# EAGLE design SuperTester-v08 (EAGLE 6.5.0)
FIRST Robotics Team 997 SuperTester An all-in-one tester to combine a multiple number of electronic system testers into one unit.
DATABASE: ./BOM/SuperTester-PARTSDB.txt; REVISION: D
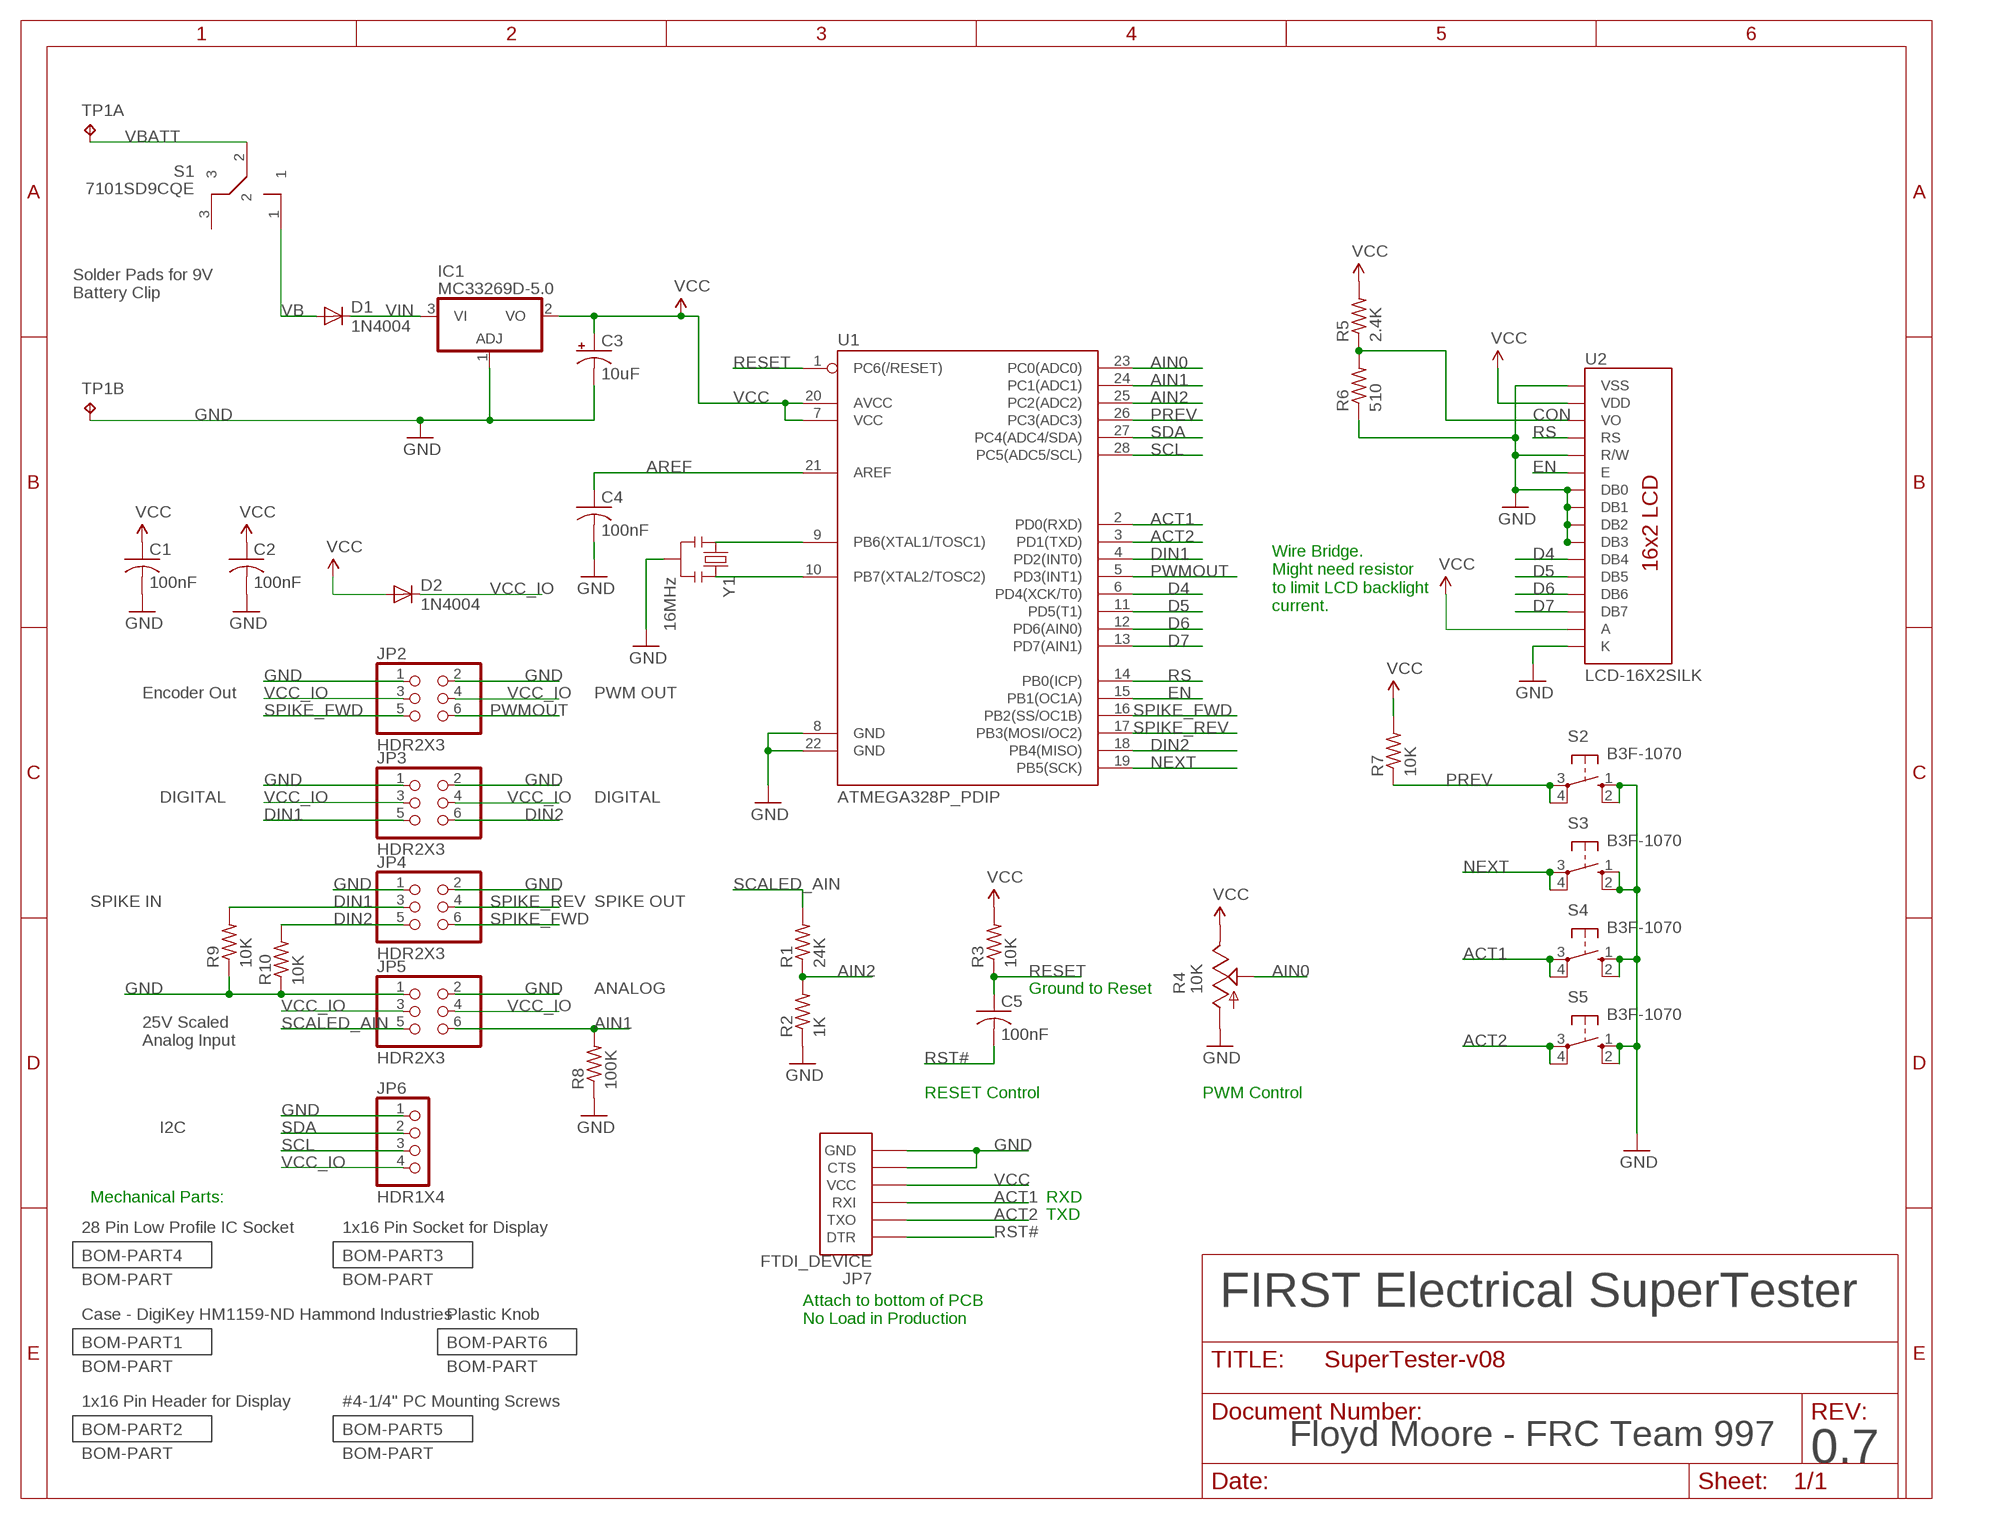
[diagram p0: schematic, sheet 1]
BOM-PART1 (BOM-PART): BOM: INCLUDE; DESC: Case - DigiKey HM1159-ND Hammond Industries; PARTNO: 1553DTBUBKBAT; QTY: 1
BOM-PART2 (BOM-PART): BOM: INCLUDE; DESC: 1x16 Pin Header for Display; PARTNO: 68002-116HLF; QTY: 1
BOM-PART3 (BOM-PART): BOM: INCLUDE; DESC: 1x16 Pin Socket for Display; PARTNO: PPTC161LFBN-RC; QTY: 1
BOM-PART4 (BOM-PART): BOM: INCLUDE; DESC: 28 Pin Low Profile IC Socket; PARTNO: 1-390261-9; QTY: 1
BOM-PART5 (BOM-PART): BOM: INCLUDE; DESC: #4-1/4" PC Mounting Screws; PARTNO: 1593ATS50; QTY: 1
BOM-PART6 (BOM-PART): BOM: INCLUDE; DESC: Plastic Knob; PARTNO: 450-AE186; QTY: 1

## Parts
C1  100nF  C-US025-025X050  [C025-025X050]
C2  100nF  C-US025-025X050  [C025-025X050]
C3  10uF  CPOL-USE2,5-6E  [E2,5-6E]
C4  100nF  C-US025-025X050  [C025-025X050]
C5  100nF  C-US025-025X050  [C025-025X050]
D1  1N4004  [DO41-10]
D2  1N4004  [DO41-10]
IC1  MC33269D-5.0  [DPACK]
JP2  HDR2X3  PINHD-2X3/90  [2X03/90]
JP3  HDR2X3  PINHD-2X3/90  [2X03/90]
JP4  HDR2X3  PINHD-2X3/90  [2X03/90]
JP5  HDR2X3  PINHD-2X3/90  [2X03/90]
JP6  HDR1X4  PINHD-1X4/90  [1X04/90]
JP7  FTDI_DEVICE  [FTDI_DEVICE_SIDE]
R1  24K  R-US_0207/7  [0207/7]
R2  1K  R-US_0207/7  [0207/7]
R3  10K  R-US_0207/7  [0207/7]
R4  10K  US-EVUF3A  [EVUF]
R5  2.4K  R-US_0207/7  [0207/7]
R6  510  R-US_0207/7  [0207/7]
R7  10K  R-US_0207/7  [0207/7]
R8  100K  R-US_0207/7  [0207/7]
R9  10K  R-US_0207/7  [0207/7]
R10  10K  R-US_0207/7  [0207/7]
S1  7101SD9CQE  CK7101CK7101  [CK7101SD9CQE]
S2  B3F-1070  10-XX  [B3F-10XX]
S3  B3F-1070  10-XX  [B3F-10XX]
S4  B3F-1070  10-XX  [B3F-10XX]
S5  B3F-1070  10-XX  [B3F-10XX]
TP1  TP2P2-38-20  [P2-38-20]
U1  ATMEGA328P_PDIP  [DIL28-3]
U2  LCD-16X2SILK  [LCD-16X2]
Y1  16MHz  RESONATORPTH  [RESONATOR-PTH]

## Nets
ACT1: JP7.P$3(RXI) S4.3(P) S4.4(P1) U1.2(PD0(RXD))
ACT2: JP7.P$2(TXO) S5.3(P) S5.4(P1) U1.3(PD1(TXD))
AIN0: R4.2(S) U1.23(PC0(ADC0))
AIN1: JP5.6 R8.2 U1.24(PC1(ADC1))
AIN2: R1.1 R2.2 U1.25(PC2(ADC2))
AREF: C4.1 U1.21(AREF)
CON [SUPPLY]: R5.1 R6.2 U2.3(VO)
D4: U1.6(PD4(XCK/T0)) U2.11(DB4)
D5: U1.11(PD5(T1)) U2.12(DB5)
D6: U1.12(PD6(AIN0)) U2.13(DB6)
D7: U1.13(PD7(AIN1)) U2.14(DB7)
DIN1: JP3.5 JP4.3 R9.2 U1.4(PD2(INT0))
DIN2: JP3.6 JP4.5 R10.2 U1.18(PB4(MISO))
EN: U1.15(PB1(OC1A)) U2.6(E)
GND [SUPPLY]: C1.2 C2.2 C3.- C4.2 IC1.1(ADJ) JP2.1 JP2.2 JP3.1 JP3.2 JP4.1 JP4.2 JP5.1 JP5.2 JP6.1 JP7.P$5(CTS) JP7.P$6(GND) R2.1 R4.1(A) R6.1 R8.1 R9.1 R10.1 S2.1(S) S2.2(S1) S3.1(S) S3.2(S1) S4.1(S) S4.2(S1) S5.1(S) S5.2(S1) TP1.TP-2 U1.8(GND) U1.22(GND) U2.1(VSS) U2.5(R/W) U2.7(DB0) U2.8(DB1) U2.9(DB2) U2.10(DB3) U2.16(K) Y1.2
NEXT: S3.3(P) S3.4(P1) U1.19(PB5(SCK))
PREV: R7.1 S2.3(P) S2.4(P1) U1.26(PC3(ADC3))
PWMOUT: JP2.6 U1.5(PD3(INT1))
RESET: C5.1 R3.1 U1.1(PC6(/RESET))
RS: U1.14(PB0(ICP)) U2.4(RS)
RST#: C5.2 JP7.P$1(DTR)
SCALED_AIN: JP5.5 R1.2
SCL: JP6.3 U1.28(PC5(ADC5/SCL))
SDA: JP6.2 U1.27(PC4(ADC4/SDA))
SPIKE_FWD: JP2.5 JP4.6 U1.16(PB2(SS/OC1B))
SPIKE_REV: JP4.4 U1.17(PB3(MOSI/OC2))
VB [SUPPLY]: D1.A S1.1
VBATT [SUPPLY]: S1.2 TP1.TP-1
VCC [SUPPLY]: C1.1 C2.1 C3.+ D2.A IC1.2(VO) JP7.P$4(VCC) R3.2 R4.3(E) R5.2 R7.2 U1.7(VCC) U1.20(AVCC) U2.2(VDD) U2.15(A)
VCC_IO [SUPPLY]: D2.C JP2.3 JP2.4 JP3.3 JP3.4 JP5.3 JP5.4 JP6.4
VIN [SUPPLY]: D1.C IC1.3(VI)
XTAL1: U1.9(PB6(XTAL1/TOSC1)) Y1.1
XTAL2: U1.10(PB7(XTAL2/TOSC2)) Y1.3
Unconnected: S1.3

## Notes on the sheet
- Solder Pads for 9V
  Battery Clip
- Wire Bridge.
  Might need resistor
  to limit LCD backlight
  current.
- Encoder Out | PWM OUT
- DIGITAL | DIGITAL
- SPIKE IN | SPIKE OUT
- ANALOG | Ground to Reset
- 25V Scaled
  Analog Input
- RESET Control | PWM Control
- I2C
- Mechanical Parts: | RXD
- TXD
- FIRST Electrical SuperTester
- Attach to bottom of PCB
  No Load in Production
- Floyd Moore - FRC Team 997
- 0.7

## Library data of the parts
C1 C2 C4 C5 = resistor:C-US: CAPACITOR, American symbol; PARTNO: SR295E104MAR
C3 = resistor:CPOL-US: POLARIZED CAPACITOR, American symbol; PARTNO: TAP106M025SCS
D1 D2 = diode:1N4004: DIODE general purpose rectifier, 1 A; PARTNO: 1N4004GP-E3/54
IC1 = linear:MC33269?*: Adjustable Output Low Dropout Voltage Regulator 800 mA Source: http://www.onsemi.com/pub/Collateral/MC33269-D.PDF; PARTNO: MC33269DTRK-5.0G
JP2-JP5 = pinhead:PINHD-2X3: PIN HEADER; PARTNO: 68021-206HLF
JP6 = pinhead:PINHD-1X4: PIN HEADER; PARTNO: 68016-204HLF
JP7 = SparkFun-Connectors:FTDI_DEVICE: Connector which mates to FTDI basic or FTDI cable.; PARTNO: 825437-6
R1 = resistor:R-US_: RESISTOR, American symbol; PARTNO: CFR-12JB-52-24K
R2 = resistor:R-US_: RESISTOR, American symbol; PARTNO: CFR-12JB-52-1K
R3 R7 R9 R10 = resistor:R-US_: RESISTOR, American symbol; PARTNO: CFR-12JB-52-10K
R4 = pot:US-EVU: 9 mm Square Rotary Potentiometers Source: Panasonic; PARTNO: EVU-F3AF30B14
R5 = resistor:R-US_: RESISTOR, American symbol; PARTNO: CFR-12JB-52-2K4
R6 = resistor:R-US_: RESISTOR, American symbol; PARTNO: CFR-12JB-52-510R
R8 = resistor:R-US_: RESISTOR, American symbol; PARTNO: CFR-12JB-52-100K
S1 = ckswitch:CK7101: C&K 7101 SPDT Toggle Switch; PARTNO: 7101SD9CQE
S2-S5 = switch-omron:10-XX: OMRON SWITCH; MPN: B3F-1000; OC_FARNELL: 176432; OC_NEWARK: 36M3542; PARTNO: B3F-1070
TP1 = testpad:TP2: Test pad; BOM: EXCLUDE
U1 = SparkFun-DigitalIC:ATMEGA328P_PDIP: uC used in the Arduino 32kb flash, 1k EEPROM, 2k SRAM This is the through-hole version of this chip.; PARTNO: ATMEGA328P-PU
U2 = SparkFun-Displays:LCD-16X2: Standard text-only 16x2 parallel input LCD; PARTNO: LCM-S01602DSF/A
Y1 = SparkFun-FreqCtrl:RESONATOR: Resonator Small SMD resonator. Used, eg, on the Arduino Pro/ Pro Mini boards. 8MHz- XTAL-08895 16MHz- XTAL-08900; PARTNO: CSTLS16M0X53-B0

## Net classes
0 default: width 0.152 mm, clearance 0.152 mm
1 SUPPLY: width 0.61 mm, clearance 0.254 mm

## Board
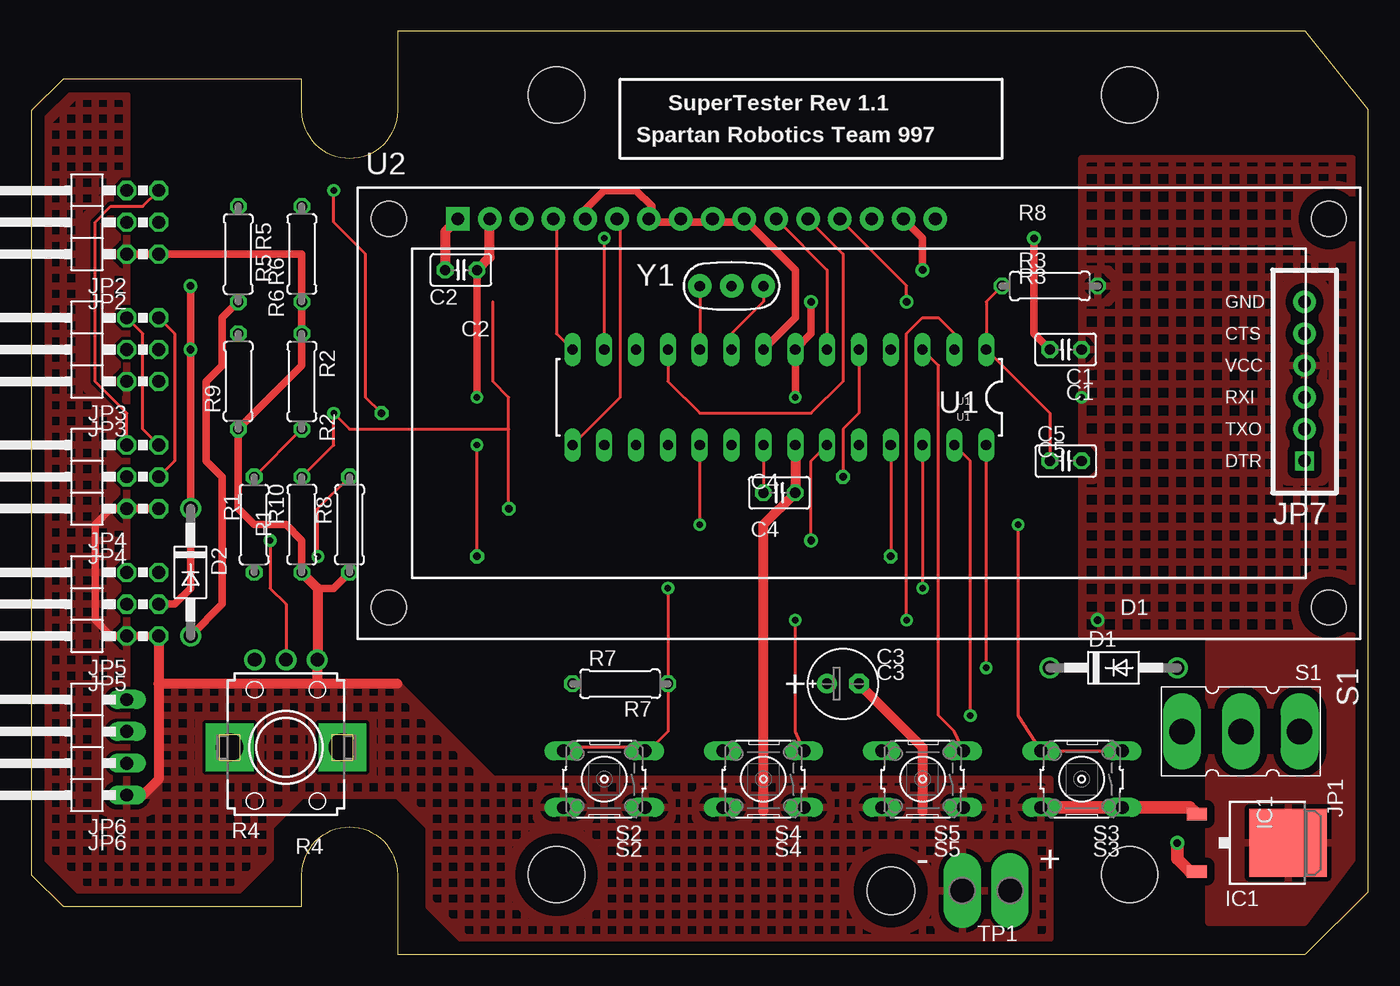
[diagram p1: board, top side]
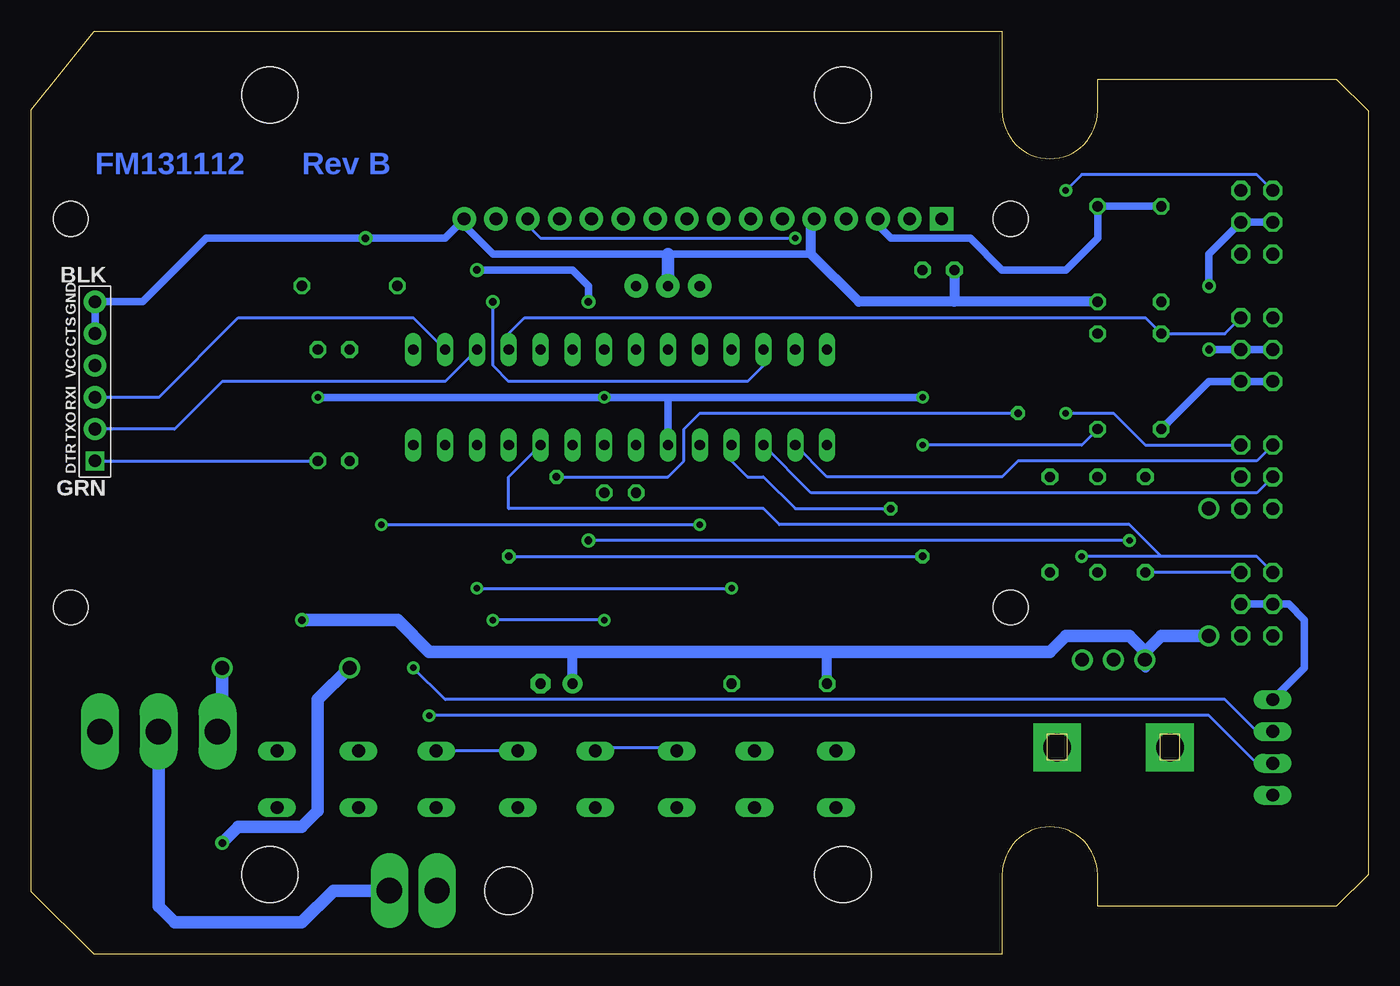
[diagram p2: board, bottom side, seen from below]

Size 106.68 x 73.66 mm. Coordinates in mm from the lower left corner, seen from the top.
Outline: 21.59,69.85 2.54,69.85 0,67.31 0,6.35 2.54,3.81 21.59,3.81 21.59,6.35 arc-180 29.21,6.35 29.21,0 101.68,0 106.68,5 106.68,67.39 101.68,73.66 29.21,73.66 29.21,67.31 arc-180 21.59,67.31 21.59,69.85
Copper layers (1*16): Top 0.035mm / dielectric 1.5mm / Bottom 0.035mm
Design rules "floyds": minimum track width 10mil, minimum drill 20mil, track to track 10mil, track to pad 10mil, pad to pad 10mil, via to via 10mil, smd to smd 10mil, copper to edge 40mil, drill to drill 10mil, minimum pad ring 10mil, minimum via ring 10mil, stop-mask expansion 4mil, vias tented up to drill 0mil, thermal gap 15mil
Holes 4.5 mm at 87.63,68.58 87.63,6.35 41.91,68.58 41.91,6.35
Holes 3.81 mm at 68.58,5.08

### Footprints (pad centres in the part's own frame; a part is rotated, then mirrored left to right if it is on the bottom)
C025-025X050 = drill 0.813 octagon: 1 -1.27,0; 2 1.27,0
E2,5-6E = drill 0.813 pad 1.575: + -1.27,0 | drill 0.813 pad 1.575 octagon: - 1.27,0
DO41-10 = drill 1.118: A 5.08,0; C -5.08,0
DPACK = smd 1 x 1.6: 1 -2.28,-4.8; 3 2.28,-4.8 | smd 5.4 x 6.2: 2 0,2.5
2X03/90 = drill 1.016 octagon: 1 -2.54,-6.35; 2 -2.54,-3.81; 3 0,-6.35; 4 0,-3.81; 5 2.54,-6.35; 6 2.54,-3.81
1X04/90 = drill 1.016 long: 1 -3.81,-3.81; 2 -1.27,-3.81; 3 1.27,-3.81; 4 3.81,-3.81
FTDI_DEVICE_SIDE = drill 1 square: P$1 -6.35,0 | drill 1.016 pad 1.778: P$2 -3.81,0; P$3 -1.27,0; P$4 1.27,0; P$5 3.81,0; P$6 6.35,0
0207/7 = drill 0.813 octagon: 1 -3.81,0; 2 3.81,0
EVUF = drill 1.1 pad 1.676: 1 -2.5,-7; 2 0,-7; 3 2.5,-7 | drill 2.2 pad 3.81 square: M1 4.5,0; M2 -4.5,0
CK7101SD9CQE = drill 2.032 long: 1 0,-4.699; 2 0,0; 3 0,4.699
B3F-10XX = drill 1.016 long: 1 -3.251,2.261; 2 3.251,2.261; 3 -3.251,-2.261; 4 3.251,-2.261
P2-38-20 = drill 2.007 pad 2.54 long: TP-1 -1.905,0; TP-2 1.905,0
DIL28-3 = drill 0.813 long: 1 -16.51,-3.81; 2 -13.97,-3.81; 3 -11.43,-3.81; 4 -8.89,-3.81; 5 -6.35,-3.81; 6 -3.81,-3.81; 7 -1.27,-3.81; 8 1.27,-3.81; 9 3.81,-3.81; 10 6.35,-3.81; 11 8.89,-3.81; 12 11.43,-3.81; 13 13.97,-3.81; 14 16.51,-3.81; 15 16.51,3.81; 16 13.97,3.81; 17 11.43,3.81; 18 8.89,3.81; 19 6.35,3.81; 20 3.81,3.81; 21 1.27,3.81; 22 -1.27,3.81; 23 -3.81,3.81; 24 -6.35,3.81; 25 -8.89,3.81; 26 -11.43,3.81; 27 -13.97,3.81; 28 -16.51,3.81
LCD-16X2 = drill 1.016 pad 1.88 square: 1 -32,15.5 | drill 1.016 pad 1.88: 2 -29.46,15.5; 3 -26.92,15.5; 4 -24.38,15.5; 5 -21.84,15.5; 6 -19.3,15.5; 7 -16.76,15.5; 8 -14.22,15.5; 9 -11.68,15.5; 10 -9.14,15.5; 11 -6.6,15.5; 12 -4.06,15.5; 13 -1.52,15.5; 14 1.02,15.5; 15 3.56,15.5; 16 6.1,15.5 | hole 2.8: -37.5,15.5; -37.5,-15.5; 37.5,15.5; 37.5,-15.5
RESONATOR-PTH = drill 0.8 pad 1.88: 1 -2.54,0; 2 0,0; 3 2.54,0

### Placement (x,y rotation side)
C1  82.55,48.26 180 top
C2  34.29,54.61 180 top
C3  64.77,21.59 0 top
C4  59.69,36.83 0 top
C5  82.55,39.37 0 top
D1  86.36,22.86 0 top
D2  12.7,30.48 270 top
IC1  97.79,8.89 270 top
JP2  3.81,58.42 90 top
JP3  3.81,48.26 90 top
JP4  3.81,38.1 90 top
JP5  3.81,27.94 90 top
JP6  3.81,16.51 90 top
JP7  101.6,45.72 90 bottom
R1  17.78,34.29 270 top
R2  21.59,45.72 270 top
R3  81.28,53.34 0 top
R4  20.32,16.51 180 top
R5  16.51,55.88 270 top
R6  21.59,55.88 90 top
R7  46.99,21.59 180 top
R8  25.4,34.29 90 top
R9  16.51,45.72 90 top
R10  21.59,34.29 90 top
S1  96.52,17.78 270 top
S2  45.72,13.97 180 top
S3  83.82,13.97 180 top
S4  58.42,13.97 180 top
S5  71.12,13.97 180 top
TP1  76.2,5.08 180 top
U1  59.69,44.45 180 top
U2  66.04,43.18 0 top
Y1  55.88,53.34 180 top

### Tracks (layer width: path | path; a pad name or v marks a point on that pad's centre or on a via)
ACT1  (via drill 0.51)
  Top 0.254: S4.3 60.96,17.78 v60.96,26.67 | v69.85,26.67 69.85,49.53 71.12,50.8 72.39,50.8 73.66,49.53 U1.2
  Bottom 0.254: S4.4 55.88,16.51 60.96,16.51 S4.3 | U1.2 76.2,50.8 90.17,50.8 96.52,44.45 JP7.P$3 | v60.96,26.67 v69.85,26.67
ACT2
  Top 0.254: S5.3 73.66,17.78 72.39,19.05 72.39,46.99 U1.3
  Bottom 0.254: U1.3 73.66,45.72 91.44,45.72 95.25,41.91 JP7.P$2 | S5.4 S5.3
AIN0  (via drill 0.51, 0.61)
  Top 0.254: U1.23 62.23,39.37 v62.23,33.02 | R4.2 20.32,27.94 19.05,29.21 v19.05,33.02
  Bottom 0.254: v19.05,33.02 v62.23,33.02
AIN1  (via drill 0.51)
  Top 0.254: R8.2 22.86,35.56 v22.86,31.75
  Bottom 0.254: 16.51,31.75 8.89,31.75 JP5.6 | 16.51,31.75 v22.86,31.75 | U1.24 68.58,38.1 68.58,35.56 48.26,35.56 46.99,34.29 19.05,34.29 16.51,31.75
AIN2  (via drill 0.51, 0.6)
  Top 0.254: R1.1 R2.2 | U1.25 v68.58,31.75 | v35.56,31.75 v35.56,40.64
  Bottom 0.254: R2.2 22.86,40.64 v35.56,40.64 | v68.58,31.75 v35.56,31.75
AREF
  Top 0.254: U1.21 C4.1
CON
  Bottom 0.61: R5.1 R6.2 21.59,57.15 24.13,54.61 29.21,54.61 31.75,57.15 38.1,57.15 39.37,58.42 39.37,58.43 U2.3
D4
  Top 0.254: U1.6 63.5,54.61 59.69,58.42 U2.11
D5
  Top 0.254: U2.12 62.23,58.42 64.77,55.88 64.77,45.72 62.23,43.18 53.34,43.18 50.8,45.72 U1.11
D6  (via drill 0.6)
  Top 0.254: v69.85,52.07 69.85,53.35 U2.13
  Bottom 0.254: U1.12 48.26,46.99 49.53,45.72 68.58,45.72 69.85,46.99 v69.85,52.07
D7  (via drill 0.51)
  Top 0.254: v45.72,57.15 U1.13
  Bottom 0.254: v45.72,57.15 66.04,57.15 67.06,58.17 U2.14
DIN1
  Top 0.254: JP3.5 11.43,49.53 11.43,39.37 JP4.3
  Bottom 0.254: U1.4 68.58,49.53 67.31,50.8 17.78,50.8 R9.2 11.43,49.53 JP3.5
DIN2  (via drill 0.51, 0.6)
  Top 0.254: JP3.6 8.89,49.53 8.89,41.91 JP4.5 | R10.2 24.13,40.64 v24.13,43.18 25.4,41.91 38.1,41.91 | 36.83,52.07 36.83,45.72 38.1,44.45 38.1,41.91 | v38.1,35.56 38.1,41.91
  Bottom 0.254: v24.13,43.18 20.32,43.18 17.78,40.64 JP4.5 | U1.18 50.8,39.37 49.53,38.1 48.26,38.1 45.72,35.56 v38.1,35.56
EN
  Top 0.254: U1.15 46.99,44.45 46.99,58.42 U2.6
GND  (via drill 0.6)
  Top 0.61: JP2.2 JP2.1 21.59,55.88 R6.1 R2.1 21.59,46.99 R9.1 16.51,35.56 17.78,34.29 20.32,34.29 21.59,33.02 R10.1 | JP4.1 JP4.2 6.35,35.56 5.08,34.29 5.08,26.67 6.35,25.4 JP5.2 JP5.1 | 8.89,12.7 JP6.1 | C1.2 80.01,49.53 v80.01,57.15 | 52.07,58.42 49.53,58.42 U2.7 49.53,58.93 49.53,59.69 48.26,60.96 45.72,60.96 44.2,59.44 U2.5 | 52.07,58.42 54.61,58.42 | 52.07,58.42 U2.8 | U1.8 60.96,50.8 60.96,54.61 57.15,58.42 | 57.15,58.42 54.61,58.42 | 54.61,58.42 U2.9 | 57.15,58.42 U2.10 | R8.1 24.13,29.21 22.86,29.21
  Top 0.813: U1.22 C4.2 58.42,34.29 58.42,11.43 | JP5.1 10.16,21.59 | 10.16,21.59 10.16,13.97 8.89,12.7 | 73.66,11.43 S5.1 74.93,11.43 | 80.01,11.43 S3.2 | 29.21,21.59 22.86,21.59 | 22.86,21.59 10.16,21.59 | C3.- 71.12,16.51 71.12,11.43 | U2.1 33.02,57.66 C2.2 | R10.1 22.86,29.21 22.86,23.55 R4.1 22.82,21.63 22.86,21.59
  Top 1.016: S3.2 S3.1 92.43,11.71 92.71,11.43 92.73,11.43 IC1.1
  Bottom 0.61: JP3.2 JP3.1 12.7,45.72 R9.1 | 44.45,55.88 55.88,55.88 69.85,55.88 72.39,58.42 73.66,57.15 v80.01,57.15 92.71,57.15 97.79,52.07 JP7.P$6 JP7.P$5 | 44.45,58.43 U2.5
  Bottom 0.813: R6.1 33.02,52.07 | 33.02,52.07 40.64,52.07 44.45,55.88 44.45,58.43 | C2.2 33.02,52.07
  Bottom 1.016: Y1.2 55.88,55.88 | U2.16 72.39,58.42
  pour Top (hatched): 1.27,67.31 1.27,7.62 3.81,5.08 7.62,5.08 7.62,22.86 7.62,68.58 2.54,68.58
  pour Top (hatched): 81.28,13.97 81.28,1.27 34.29,1.27 31.75,3.81 31.75,10.16 29.21,12.7 21.59,12.7 19.05,10.16 19.05,7.62 16.51,5.08 7.62,5.08 7.62,12.7 8.89,12.7 10.16,13.97 10.16,21.59 29.21,21.59 36.83,13.97
NEXT  (via drill 0.51)
  Top 0.254: v53.34,34.29 U1.19 | v78.74,34.29 78.74,19.05 S3.4 S3.3
  Bottom 0.254: v78.74,34.29 v53.34,34.29
PREV  (via drill 0.51)
  Top 0.254: S2.4 43.18,16.51 48.26,16.51 S2.3 49.25,16.51 49.53,16.51 50.8,17.78 R7.1 v50.8,29.21 | U1.26 v71.12,29.21
  Bottom 0.254: v71.12,29.21 v50.8,29.21
PWMOUT  (via drill 0.51, 0.6)
  Top 0.254: v27.94,43.18 26.67,44.45 26.67,55.88 24.13,58.42 v24.13,60.96 | U1.5 66.04,43.18 64.77,41.91 v64.77,38.1
  Bottom 0.254: JP2.6 8.89,62.23 22.86,62.23 v24.13,60.96 | v64.77,38.1 55.88,38.1 54.61,39.37 54.61,41.91 53.34,43.18 v27.94,43.18
RESET
  Top 0.254: R3.1 76.2,52.07 U1.1 81.28,43.18 C5.1
RS
  Top 0.254: U1.14 41.91,49.53 41.91,58.42 U2.4
RST#
  Bottom 0.254: JP7.P$1 C5.2
SCALED_AIN
  Bottom 0.254: JP5.5 R1.2
SCL  (via drill 0.51)
  Top 0.254: v76.2,22.86 U1.28
  Bottom 0.254: JP6.3 8.89,17.78 11.43,20.32 73.66,20.32 v76.2,22.86
SDA  (via drill 0.51)
  Top 0.254: v74.93,19.05 74.93,39.37 U1.27
  Bottom 0.254: JP6.2 8.89,15.24 12.7,19.05 v74.93,19.05
SPIKE_FWD
  Top 0.254: JP4.6 7.62,43.18 5.08,45.72 5.08,58.42 6.35,59.69 8.89,59.69 JP2.5
  Bottom 0.254: U1.16 43.18,38.1 29.21,38.1 27.94,39.37 8.89,39.37 JP4.6
SPIKE_REV
  Bottom 0.254: U1.17 44.45,36.83 8.89,36.83 JP4.4
VB
  Bottom 1.016: S1.1 91.44,18.16 D1.A
VBATT
  Bottom 1.016: TP1.TP-1 82.55,5.08 85.09,2.54 95.25,2.54 96.52,3.81 S1.2
VCC  (via drill 0.51, 0.6)
  Top 0.61: v35.56,44.45 C2.1 | v60.96,44.45 U1.7 62.23,49.53 v62.23,52.07 | D2.A 15.24,27.94 15.24,38.1 13.97,39.37 13.97,45.72 15.24,46.99 15.24,50.8 R5.2 | v71.12,54.61 71.12,57.16 U2.15
  Top 0.813: U2.2 36.58,55.63 C2.1
  Bottom 0.61: 55.88,44.45 v60.96,44.45 v83.82,44.45 | 55.88,44.45 U1.20 | 55.88,44.45 v35.56,44.45 | R4.3 17.82,22.9 17.78,22.86 | v62.23,52.07 62.23,53.34 63.5,54.61 v71.12,54.61
  Bottom 0.813: 17.78,24.13 17.78,22.86 | R7.2 43.18,24.13 | C3.+ 63.5,24.13
  Bottom 1.016: D2.A 16.51,25.4 17.78,24.13 19.05,25.4 24.13,25.4 25.4,24.13 43.18,24.13 63.5,24.13 74.93,24.13 77.47,26.67 v85.09,26.67
  pour Top (isolate 0.61): 93.98,2.54 101.6,2.54 105.41,7.62 105.41,25.4 93.98,25.4
  pour Top (isolate 0.61, hatched): 105.41,25.4 83.82,25.4 83.82,63.5 105.41,63.5
VCC_IO  (via drill 0.6)
  Top 0.61: JP5.3 11.43,27.94 12.7,29.21 D2.C v12.7,48.26 v12.7,53.34
  Bottom 0.61: v12.7,48.26 JP3.3 JP3.4 | JP2.4 JP2.3 12.7,55.88 v12.7,53.34 | JP5.3 JP5.4 6.35,27.94 5.08,26.67 5.08,22.86 JP6.4
VIN  (via drill 0.6)
  Top 1.016: IC1.3 92.45,6.61 91.44,7.62 v91.44,8.89
  Bottom 1.016: v91.44,8.89 90.17,10.16 85.09,10.16 83.82,11.43 83.82,20.32 D1.C
XTAL1
  Top 0.254: Y1.1 58.42,52.07 55.88,49.53 U1.9
XTAL2
  Top 0.254: Y1.3 U1.10

### Text on the board
Bottom: Rev B | FM131112
tPlace: +
tNames: SuperTester Rev 1.1 | Spartan Robotics Team 997 | U2 | Y1 | GND | CTS | VCC | RXI | U1 | TXO | DTR | JP7 | - | +
tCream: VIN
_tNames: R8 | R5 | JP2 | R3 | R6 | C2 | C1 | JP3 | R2 | U1 | C5 | C4 | R1 | JP4 | D1 | R7 | S1 | JP5 | C3 | JP1 | IC1 | JP6 | R4 | S2 | S4 | S5 | S3